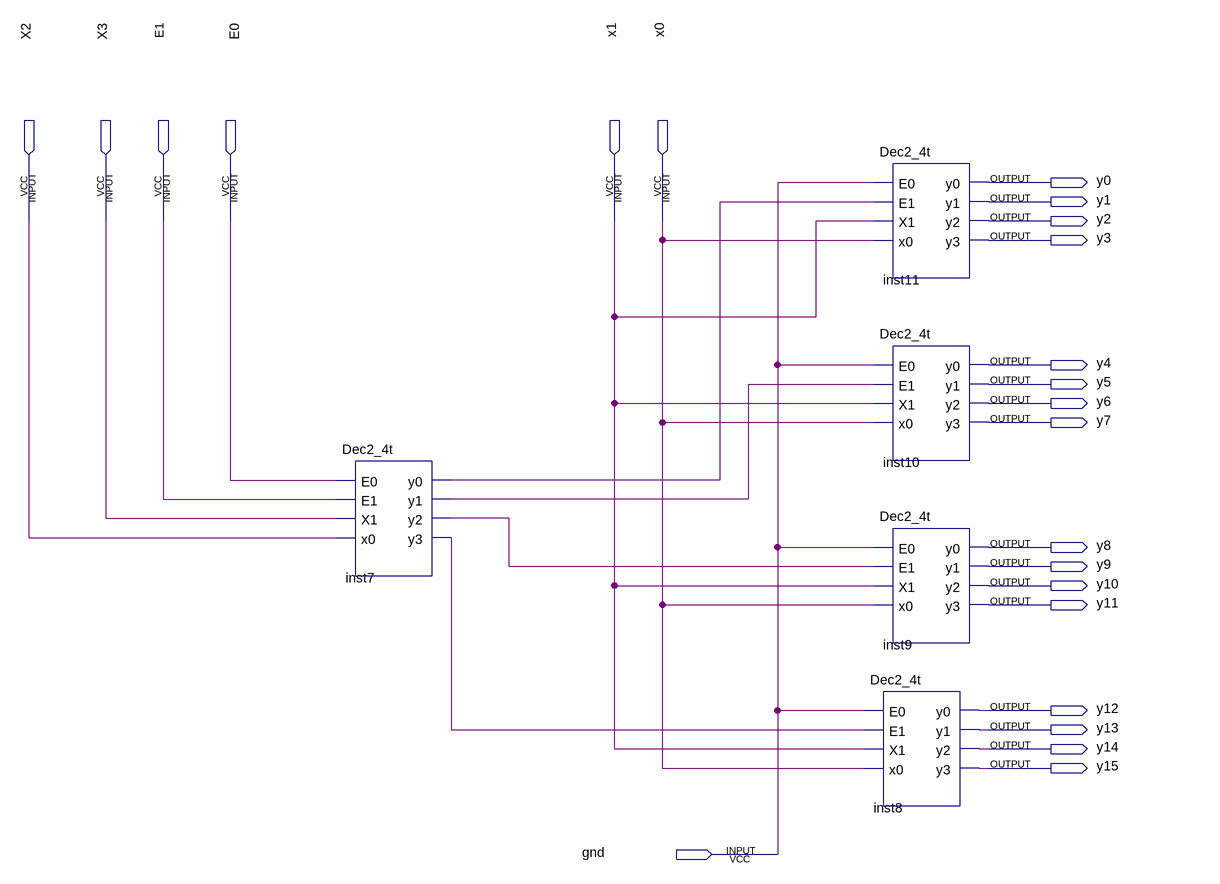
[diagram p0: schematic sheet]
// Quartus schematic Dec4_16.bdf as structural Verilog: 5 symbols, 23 pins
module Dec4_16 (
  input  X2,
  input  X3,
  input  E1,
  input  E0,
  input  x1,
  input  x0,
  input  gnd,
  output y0,
  output y1,
  output y2,
  output y3,
  output y4,
  output y5,
  output y6,
  output y7,
  output y8,
  output y9,
  output y10,
  output y11,
  output y12,
  output y13,
  output y14,
  output y15
);

  wire inst7_y0, inst7_y1, inst7_y2, inst7_y3;

  Dec2_4t inst7 (.E0(E0), .E1(E1), .X1(X3), .x0(X2), .y0(inst7_y0), .y1(inst7_y1), .y2(inst7_y2), .y3(inst7_y3));
  Dec2_4t inst11 (.E0(gnd), .E1(inst7_y0), .X1(x1), .x0(x0), .y0(y0), .y1(y1), .y2(y2), .y3(y3));
  Dec2_4t inst10 (.E0(gnd), .E1(inst7_y1), .X1(x1), .x0(x0), .y0(y4), .y1(y5), .y2(y6), .y3(y7));
  Dec2_4t inst9 (.E0(gnd), .E1(inst7_y2), .X1(x1), .x0(x0), .y0(y8), .y1(y9), .y2(y10), .y3(y11));
  Dec2_4t inst8 (.E0(gnd), .E1(inst7_y3), .X1(x1), .x0(x0), .y0(y12), .y1(y13), .y2(y14), .y3(y15));
endmodule
